# Altium schematic sheet switch_input.SchDoc
size A4
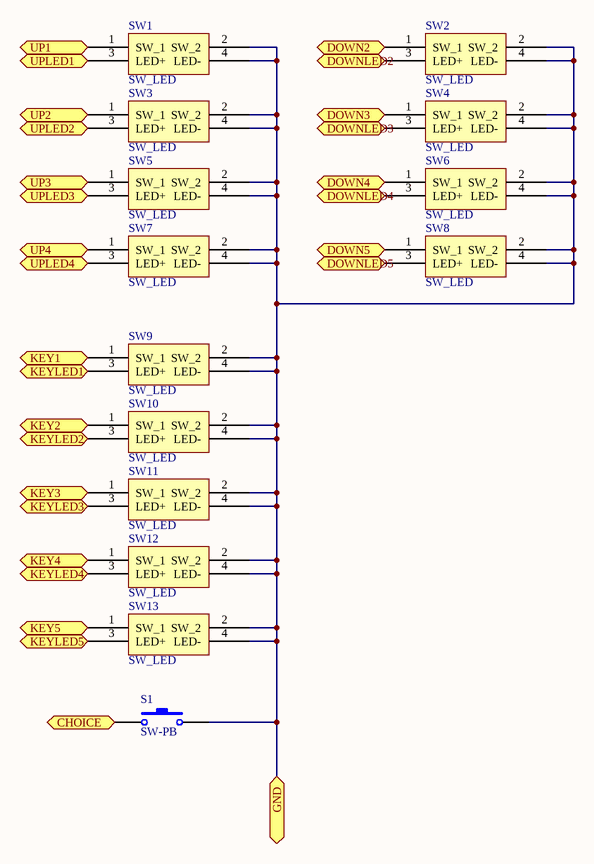
[diagram p0: switch_input.SchDoc]

## Parts
S1  SW-PB  [SW2]
SW1  SW_LED  [SW_LED]
SW2  SW_LED  [SW_LED]
SW3  SW_LED  [SW_LED]
SW4  SW_LED  [SW_LED]
SW5  SW_LED  [SW_LED]
SW6  SW_LED  [SW_LED]
SW7  SW_LED  [SW_LED]
SW8  SW_LED  [SW_LED]
SW9  SW_LED  [SW_LED]
SW10  SW_LED  [SW_LED]
SW11  SW_LED  [SW_LED]
SW12  SW_LED  [SW_LED]
SW13  SW_LED  [SW_LED]

## Ports
CHOICE, DOWN2, DOWN3, DOWN4, DOWN5, DOWNLED2, DOWNLED3, DOWNLED4, DOWNLED5, GND, KEY1, KEY2, KEY3, KEY4, KEY5, KEYLED1, KEYLED2, KEYLED3, KEYLED4, KEYLED5, UP1, UP2, UP3, UP4, UPLED1, UPLED2, UPLED3, UPLED4

## Nets
CHOICE: S1.1 ; port CHOICE
DOWN2: SW2.1(SW_1) ; port DOWN2
DOWN3: SW4.1(SW_1) ; port DOWN3
DOWN4: SW6.1(SW_1) ; port DOWN4
DOWN5: SW8.1(SW_1) ; port DOWN5
DOWNLED2: SW2.3(LED+) ; port DOWNLED2
DOWNLED3: SW4.3(LED+) ; port DOWNLED3
DOWNLED4: SW6.3(LED+) ; port DOWNLED4
DOWNLED5: SW8.3(LED+) ; port DOWNLED5
GND: S1.2 SW1.2(SW_2) SW1.4(LED-) SW2.2(SW_2) SW2.4(LED-) SW3.2(SW_2) SW3.4(LED-) SW4.2(SW_2) SW4.4(LED-) SW5.2(SW_2) SW5.4(LED-) SW6.2(SW_2) SW6.4(LED-) SW7.2(SW_2) SW7.4(LED-) SW8.2(SW_2) SW8.4(LED-) SW9.2(SW_2) SW9.4(LED-) SW10.2(SW_2) SW10.4(LED-) SW11.2(SW_2) SW11.4(LED-) SW12.2(SW_2) SW12.4(LED-) SW13.2(SW_2) SW13.4(LED-) ; port GND
KEY1: SW9.1(SW_1) ; port KEY1
KEY2: SW10.1(SW_1) ; port KEY2
KEY3: SW11.1(SW_1) ; port KEY3
KEY4: SW12.1(SW_1) ; port KEY4
KEY5: SW13.1(SW_1) ; port KEY5
KEYLED1: SW9.3(LED+) ; port KEYLED1
KEYLED2: SW10.3(LED+) ; port KEYLED2
KEYLED3: SW11.3(LED+) ; port KEYLED3
KEYLED4: SW12.3(LED+) ; port KEYLED4
KEYLED5: SW13.3(LED+) ; port KEYLED5
UP1: SW1.1(SW_1) ; port UP1
UP2: SW3.1(SW_1) ; port UP2
UP3: SW5.1(SW_1) ; port UP3
UP4: SW7.1(SW_1) ; port UP4
UPLED1: SW1.3(LED+) ; port UPLED1
UPLED2: SW3.3(LED+) ; port UPLED2
UPLED3: SW5.3(LED+) ; port UPLED3
UPLED4: SW7.3(LED+) ; port UPLED4

## Library data of the parts
S1 = SW-PB: Switch; Published: 24-Mar-1999; LatestRevisionDate: 17-Jul-2002; LatestRevisionNote: Re-released for DXP Platform.; PackageReference: SPST-2; Publisher: Altium Limited; PackageDescription: Switch; 2 Leads